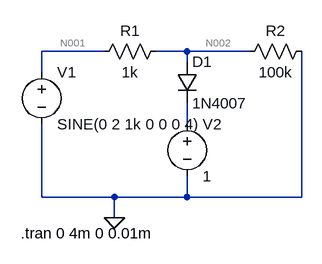
[diagram p0: schematic POSITIVE_CLIPPER.asc]
POSITIVE_CLIPPER.asc, the LTspice schematic file:
Version 4.1
SHEET 1 880 680
WIRE 144 112 48 112
WIRE 272 112 224 112
WIRE 368 112 272 112
WIRE 272 128 272 112
WIRE 48 144 48 112
WIRE 272 224 272 192
WIRE 48 336 48 224
WIRE 160 336 48 336
WIRE 272 336 272 304
WIRE 272 336 160 336
WIRE 448 336 448 112
WIRE 448 336 272 336
WIRE 160 368 160 336
FLAG 160 368 0
SYMBOL res 240 96 R90
WINDOW 0 0 56 VBottom 2
WINDOW 3 32 56 VTop 2
SYMATTR InstName R1
SYMATTR Value 1k
SYMBOL voltage 48 128 R0
WINDOW 123 0 0 Left 0
WINDOW 39 0 0 Left 0
SYMATTR InstName V1
SYMATTR Value SINE(0 2 1k 0 0 0 4)
SYMBOL diode 256 128 R0
SYMATTR InstName D1
SYMATTR Value 1N4007
SYMBOL voltage 272 208 R0
SYMATTR InstName V2
SYMATTR Value 1
SYMBOL res 464 96 R90
WINDOW 0 0 56 VBottom 2
WINDOW 3 32 56 VTop 2
SYMATTR InstName R2
SYMATTR Value 100k
TEXT 16 392 Left 2 !.tran 0 4m 0 0.01m

The netlist it stands for:
* POSITIVE_CLIPPER.asc
R1 N002 N001 1k
V1 N001 0 SINE(0 2 1k 0 0 0 4)
D1 N002 N003 1N4007
V2 N003 0 1
R2 0 N002 100k
.model D D
.lib standard.dio
.tran 0 4m 0 0.01m
.backanno
.end

* Results of the author's LTspice run, read from the files saved beside the schematic
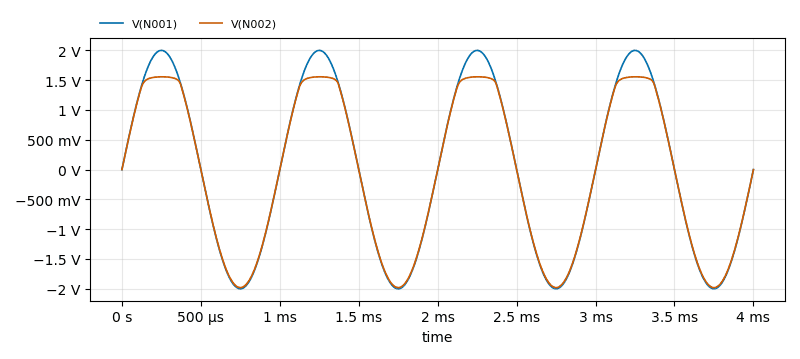
[diagram p1: Transient Analysis of POSITIVE_CLIPPER.asc, plotted from the saved traces]
* Transient Analysis, 1 run:
*   V(N001): min -2 V, max 2 V, average 22.35 µV, rms 1.414 V, last 0 V
*   V(N002): min -1.98 V, max 1.557 V, average -63.92 mV, rms 1.32 V, last -348.8 µV